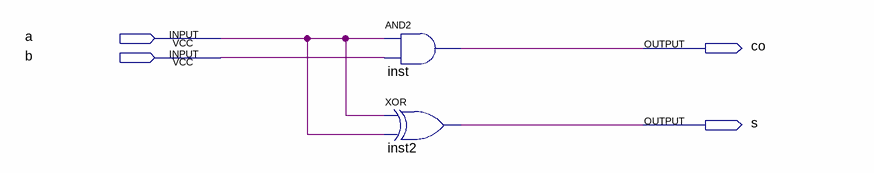
[diagram p0: schematic sheet]
// Quartus schematic adder.bdf as structural Verilog: 2 symbols, 4 pins
module adder (
  input  a,
  input  b,
  output co,
  output s
);

  and inst (co, a, b);
  xor inst2 (s, a, a);
endmodule
